# Altium schematic sheet WATCHDOG.SchDoc
size A3; SheetNumber: 17; SheetTotal: 23
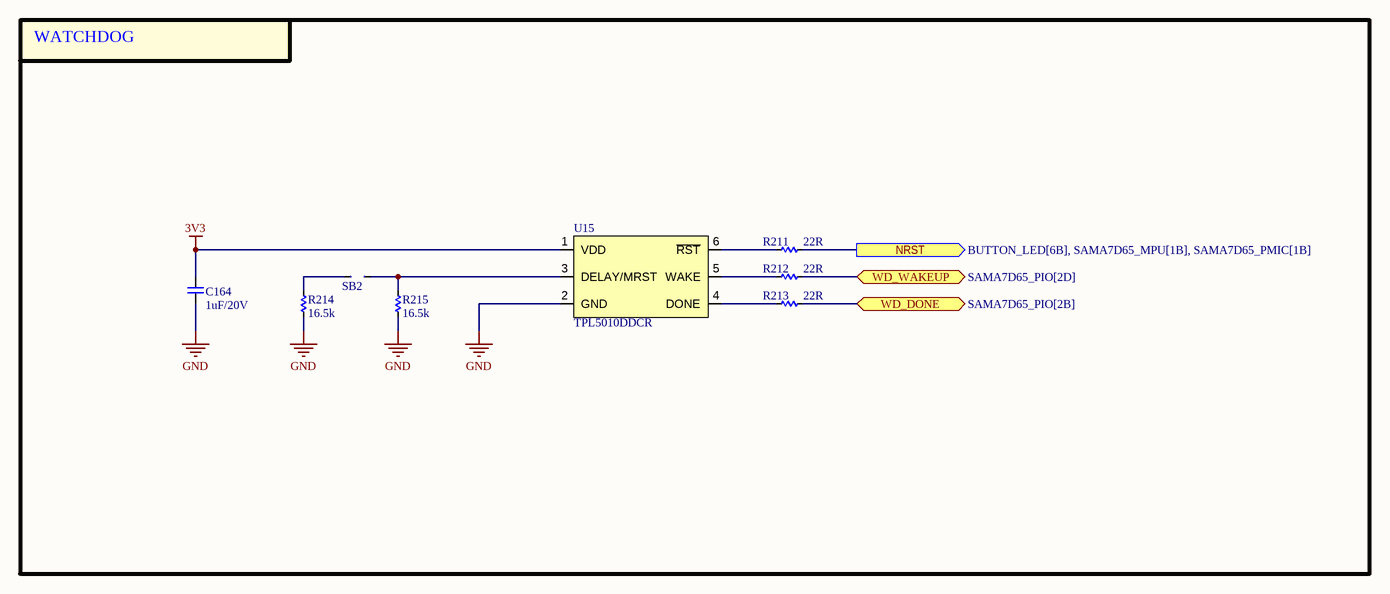
[diagram p0: WATCHDOG.SchDoc]

## Parts
C164  1uF/20V  [CAP_C_1005X50_L]
R211  22R  [RES_C_1005x30_L]
R212  22R  [RES_C_1005x30_L]
R213  22R  [RES_C_1005x30_L]
R214  16.5k  [RES_C_1005x30_L]
R215  16.5k  [RES_C_1005x30_L]
SB2  JUMPER  [JUMPER_1608]  (value not drawn)
U15  TPL5010DDCR  [TPL5010DDCR]

## Blocks framed on the sheet
WATCHDOG: C164 R211-R215 SB2 U15

## Ports
NRST (out, see BUTTON_LED[6B], SAMA7D65_MPU[1B], SAMA7D65_PMIC[1B]), WD_DONE (bidir, see SAMA7D65_PIO[2B]), WD_WAKEUP (bidir, see SAMA7D65_PIO[2D])

## Nets
3V3: C164.2 U15.1(VDD)
GND: C164.1 R214.2 R215.2 U15.2(GND)
NRST: R211.2 ; port NRST
WD_DONE: R213.2 ; port WD_DONE
WD_WAKEUP: R212.2 ; port WD_WAKEUP
NetR211_1: R211.1 U15.6(~{RST})
NetR212_1: R212.1 U15.5(WAKE)
NetR213_1: R213.1 U15.4(DONE)
NetR214_1: R214.1 SB2.1
NetR215_1: R215.1 SB2.2 U15.3(DELAY/MRST)

## Notes on the sheet
- Project:
- Page Contents:
- Revision:
- Design:
- Date:
- Size:
- A3
- Document Number:
- Sheet:
- of

## Library data of the parts
C164 = _CAP_C_2: CAP CHIP
R211-R215 = _RES_B_2: RES
U15 = TPL5010DDCR: OSC PROG TIMER TSOT23-6